# Altium schematic sheet djb_v2_jig.SchDoc
size A
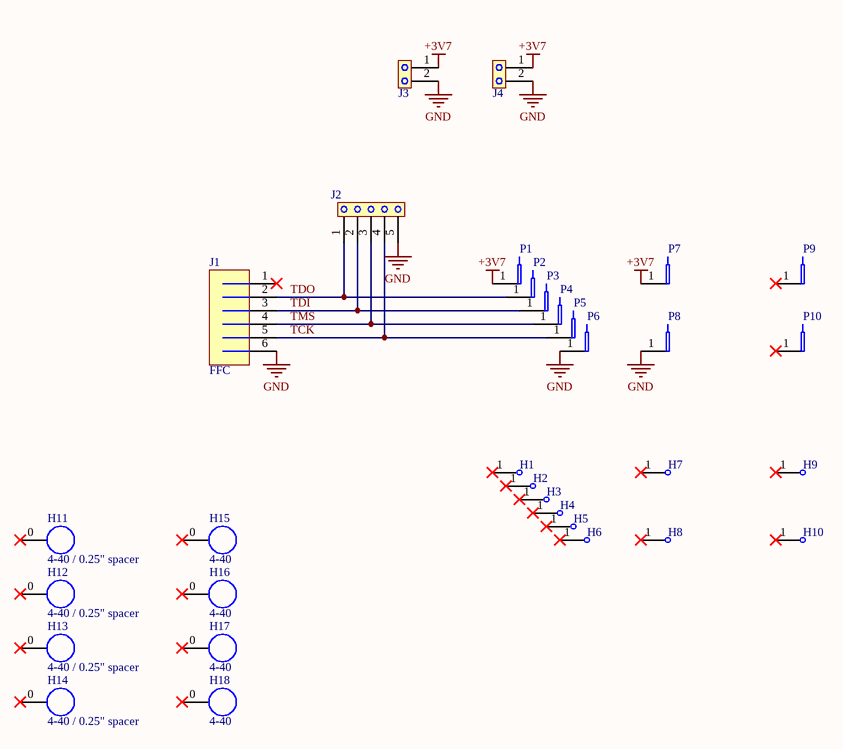
[diagram p0: djb_v2_jig.SchDoc]

## Parts
H1  SMITHS_S-00-U-1.3-G_MID  [SMITHS_S-00-U-1.3-G_MID]  (value not drawn)
H2  SMITHS_S-00-U-1.3-G_MID  [SMITHS_S-00-U-1.3-G_MID]  (value not drawn)
H3  SMITHS_S-00-U-1.3-G_MID  [SMITHS_S-00-U-1.3-G_MID]  (value not drawn)
H4  SMITHS_S-00-U-1.3-G_MID  [SMITHS_S-00-U-1.3-G_MID]  (value not drawn)
H5  SMITHS_S-00-U-1.3-G_MID  [SMITHS_S-00-U-1.3-G_MID]  (value not drawn)
H6  SMITHS_S-00-U-1.3-G_MID  [SMITHS_S-00-U-1.3-G_MID]  (value not drawn)
H7  SMITHS_S-00-U-1.3-G_MID  [SMITHS_S-00-U-1.3-G_MID]  (value not drawn)
H8  SMITHS_S-00-U-1.3-G_MID  [SMITHS_S-00-U-1.3-G_MID]  (value not drawn)
H9  SMITHS_S-00-U-1.3-G_MID  [SMITHS_S-00-U-1.3-G_MID]  (value not drawn)
H10  SMITHS_S-00-U-1.3-G_MID  [SMITHS_S-00-U-1.3-G_MID]  (value not drawn)
H11  4-40 / 0.25" spacer  [SCREW_4-40_1/4-SPACER]
H12  4-40 / 0.25" spacer  [SCREW_4-40_1/4-SPACER]
H13  4-40 / 0.25" spacer  [SCREW_4-40_1/4-SPACER]
H14  4-40 / 0.25" spacer  [SCREW_4-40_1/4-SPACER]
H15  4-40  [SCREW_4-40_BLANK]
H16  4-40  [SCREW_4-40_BLANK]
H17  4-40  [SCREW_4-40_BLANK]
H18  4-40  [SCREW_4-40_BLANK]
J1  FFC  [AMPHENOL_HFW6R-1STE1LF]
J2  HDR_5  [HDR_5]  (value not drawn)
J3  HDR_2  [HDR_2]  (value not drawn)
J4  HDR_2  [HDR_2]  (value not drawn)
P1  SMITHS_S-00-U-1.3-G_TH  [SMITHS_S-00-U-1.3-G_TH]  (value not drawn)
P2  SMITHS_S-00-U-1.3-G_TH  [SMITHS_S-00-U-1.3-G_TH]  (value not drawn)
P3  SMITHS_S-00-U-1.3-G_TH  [SMITHS_S-00-U-1.3-G_TH]  (value not drawn)
P4  SMITHS_S-00-U-1.3-G_TH  [SMITHS_S-00-U-1.3-G_TH]  (value not drawn)
P5  SMITHS_S-00-U-1.3-G_TH  [SMITHS_S-00-U-1.3-G_TH]  (value not drawn)
P6  SMITHS_S-00-U-1.3-G_TH  [SMITHS_S-00-U-1.3-G_TH]  (value not drawn)
P7  SMITHS_S-00-U-1.3-G_TH  [SMITHS_S-00-U-1.3-G_TH]  (value not drawn)
P8  SMITHS_S-00-U-1.3-G_TH  [SMITHS_S-00-U-1.3-G_TH]  (value not drawn)
P9  SMITHS_S-00-U-1.3-G_TH  [SMITHS_S-00-U-1.3-G_TH]  (value not drawn)
P10  SMITHS_S-00-U-1.3-G_TH  [SMITHS_S-00-U-1.3-G_TH]  (value not drawn)

## Nets
+3V7: J3.1 J4.1 P1.1 P7.1
GND: J1.6 J2.5 J3.2 J4.2 P6.1 P8.1
TCK: J1.5 J2.4 P5.1
TDI: J1.3 J2.2 P3.1
TDO: J1.2 J2.1 P2.1
TMS: J1.4 J2.3 P4.1

Not connected (* = marked no-connect by the designer): H1 1*; H2 1*; H3 1*; H4 1*; H5 1*; H6 1*; H7 1*; H8 1*; H9 1*; H10 1*; H11 0*; H12 0*; H13 0*; H14 0*; H15 0*; H16 0*; H17 0*; H18 0*; J1 1*; P9 1*; P10 1*

## Library data of the parts
H1-H10 = SMITHS_S-00-U-1.3-G_MID: Smiths Interconnect / IDI S-00-U-1.3-G Pogo Pin 0.99mm Centers 16.7mm Long 2.8mm Travel, Mid Mount
H11-H14 = SCREW_4-40_1/4-SPACER
H15-H18 = SCREW_4-40_EMPTY
J1 = AMPHENOL_HFW6R-1STE1LF: Amphenol HFW6R-1STE1LF 6-pin flat flexible cable connector
J2 = HDR_5: 5-pin 0.1" header
J3 J4 = HDR_2: 2-pin 0.1" header
P1-P10 = SMITHS_S-00-U-1.3-G_TH: Smiths Interconnect / IDI S-00-U-1.3-G Pogo Pin 0.99mm Centers 16.7mm Long 2.8mm Travel, Through Hole Mount